# Altium project STM32F446RE_BES.PrjPcb
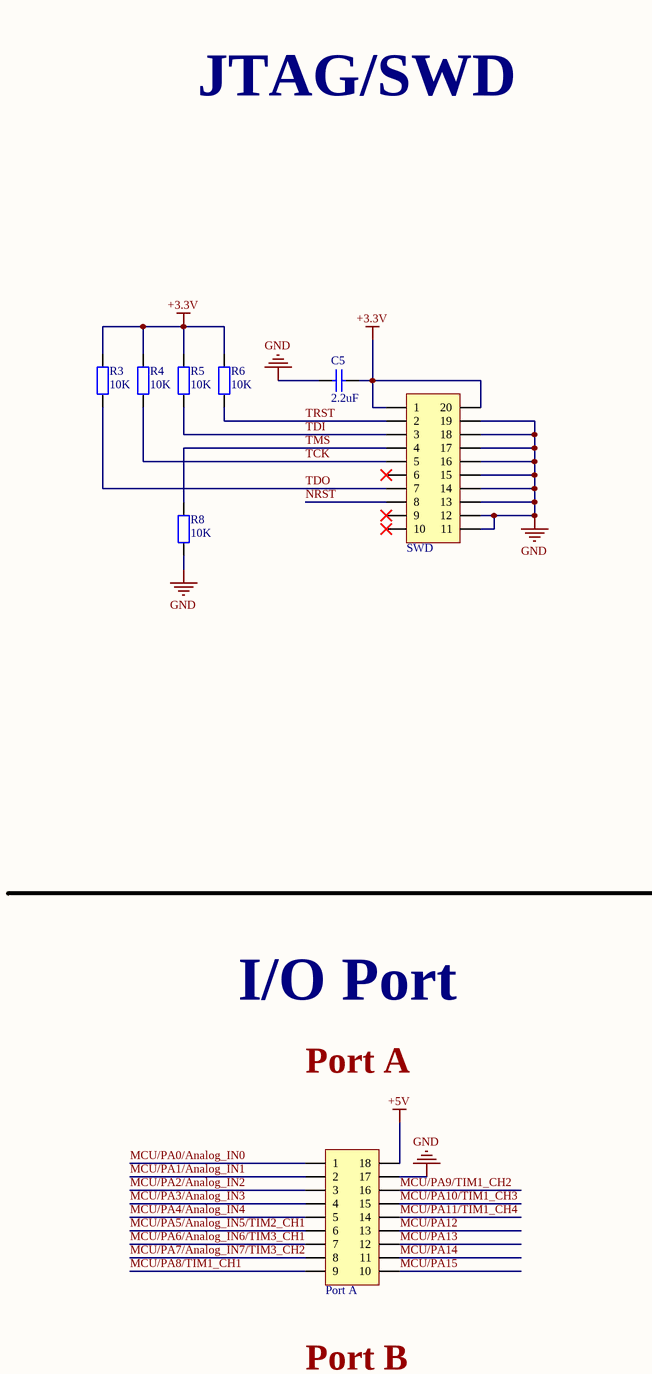
[diagram p0: STM32F446RE_BES.SchDoc, top left]
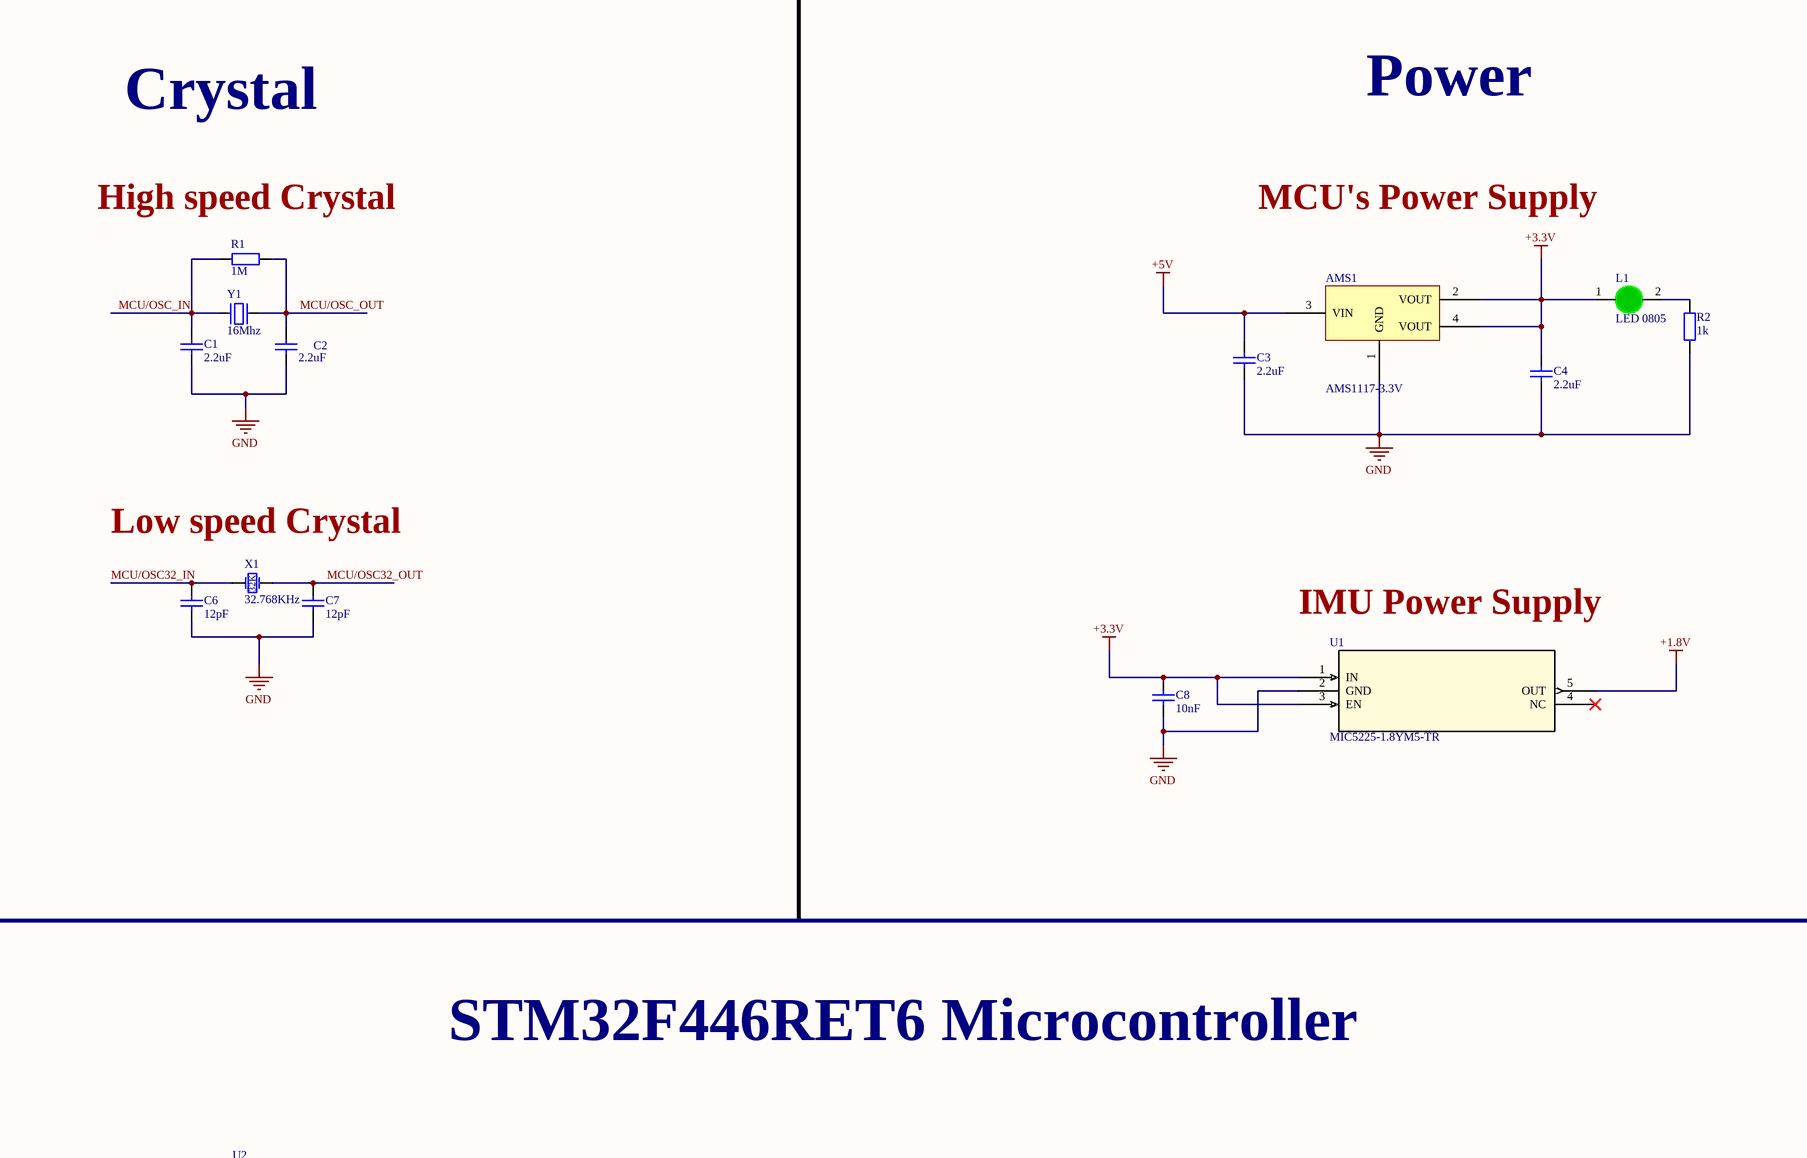
[diagram p1: STM32F446RE_BES.SchDoc, top middle]
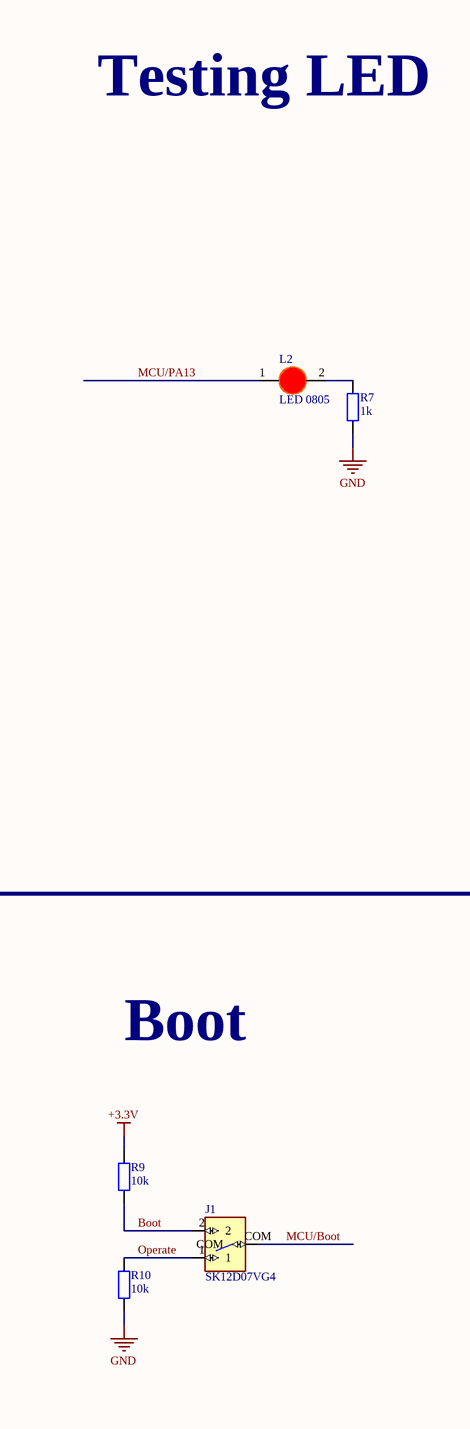
[diagram p2: STM32F446RE_BES.SchDoc, top right]
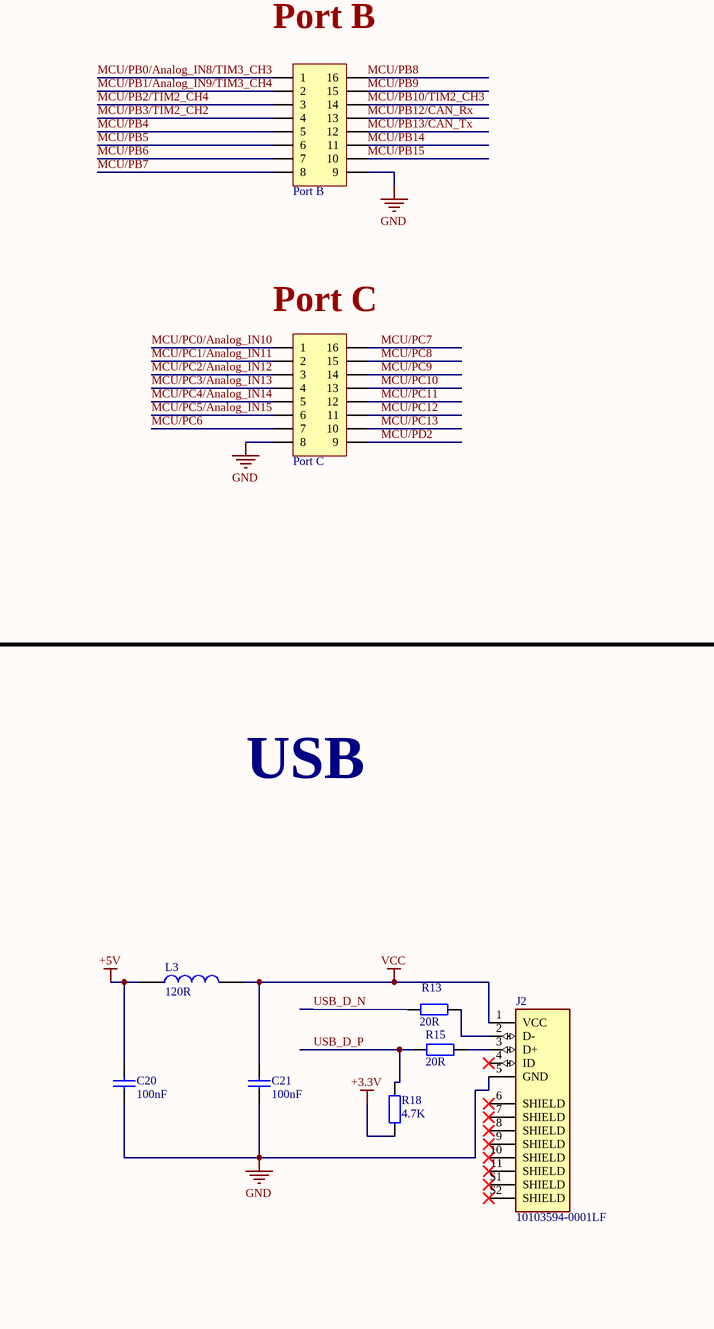
[diagram p3: STM32F446RE_BES.SchDoc, bottom left]
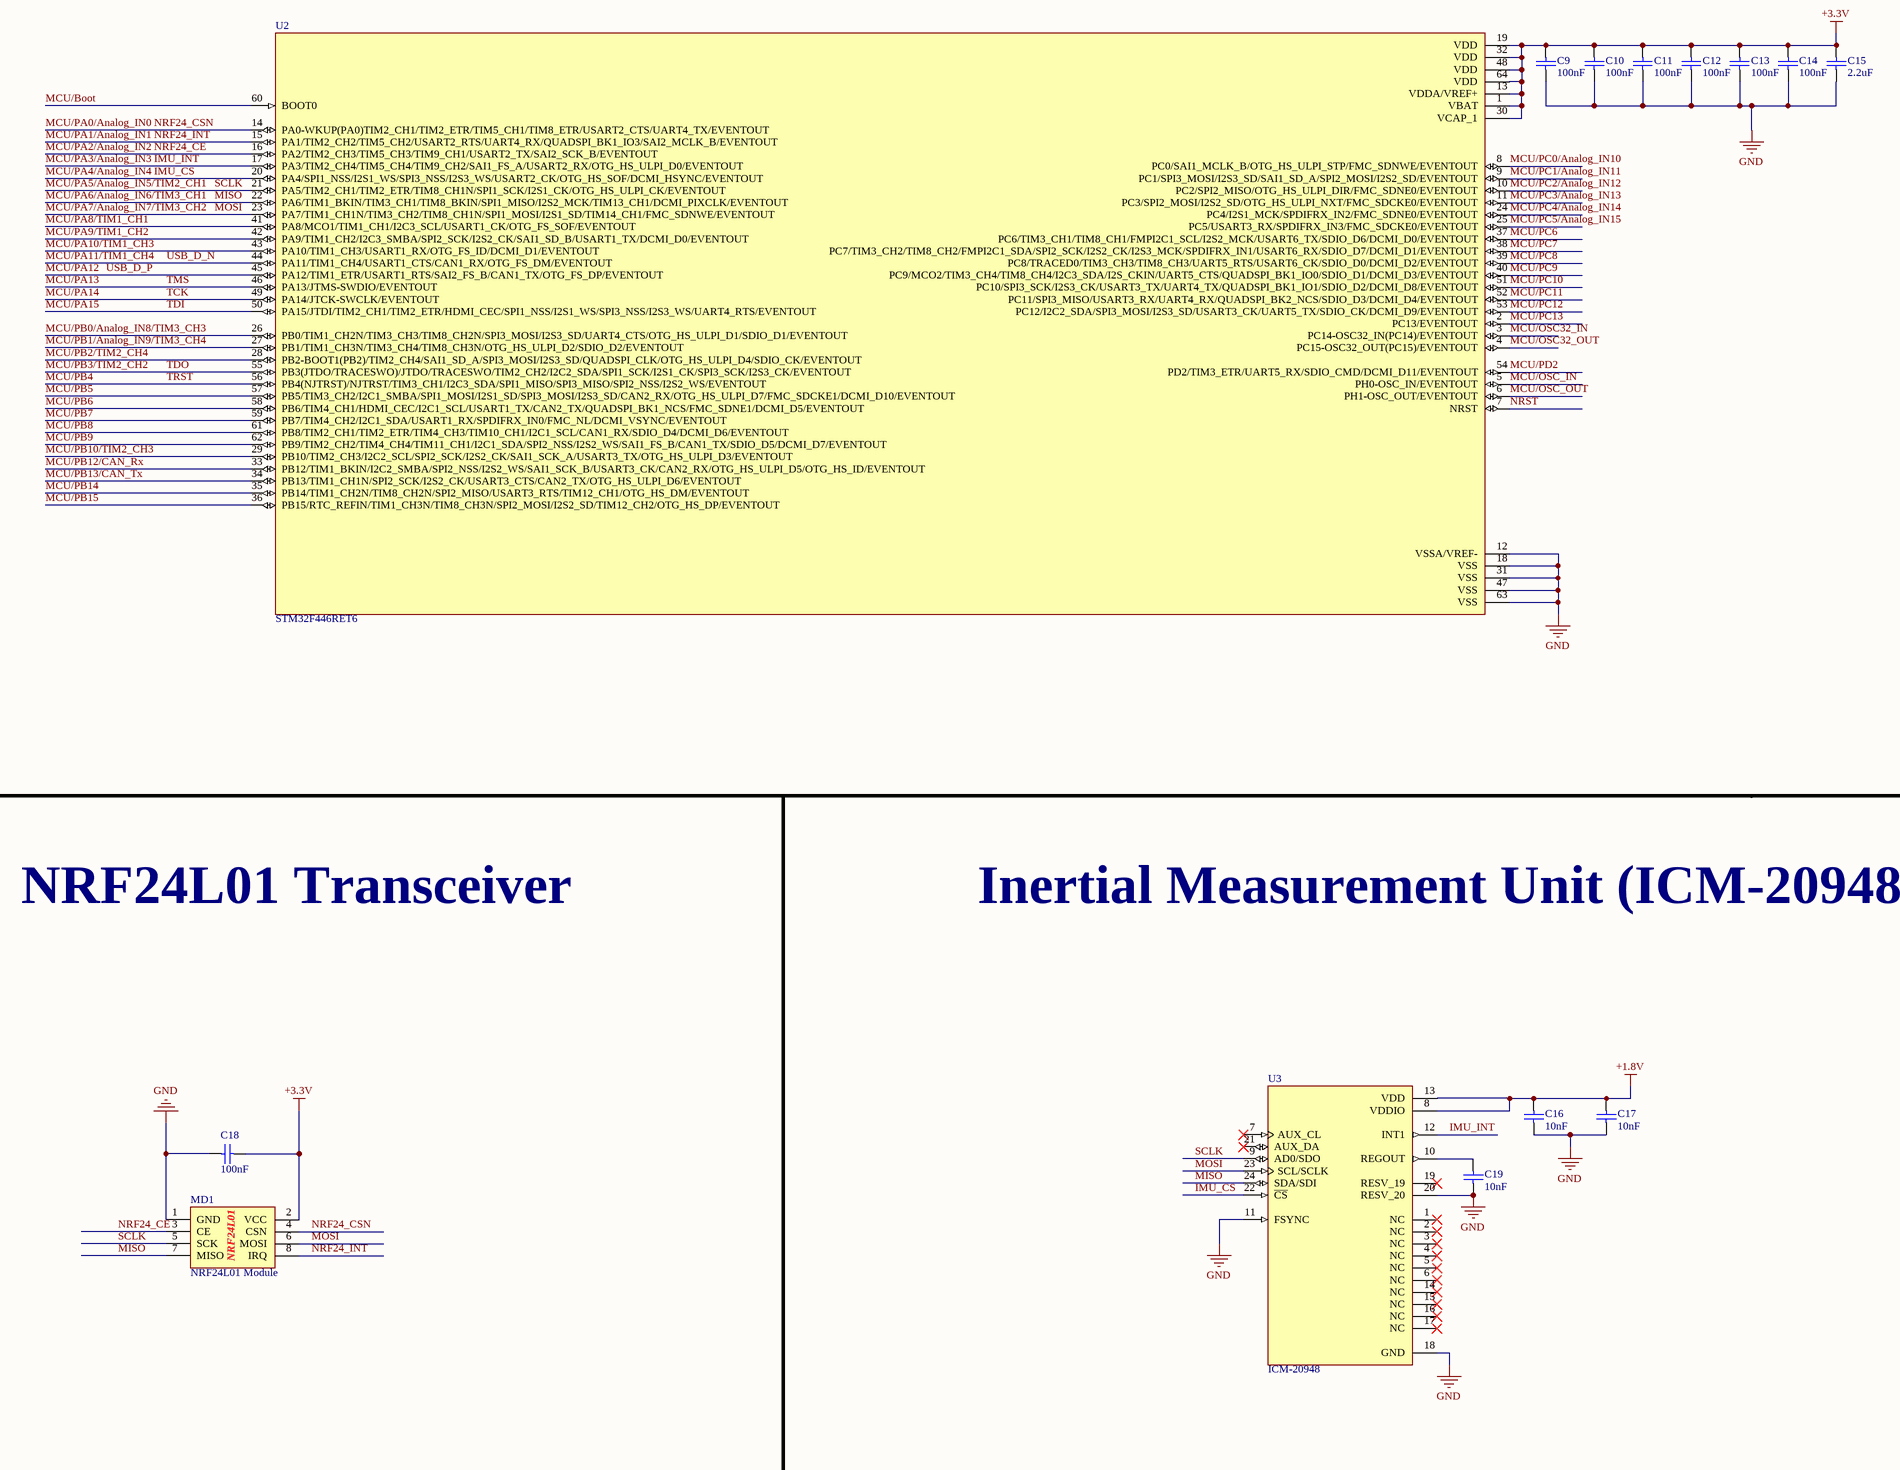
[diagram p4: STM32F446RE_BES.SchDoc, bottom middle]
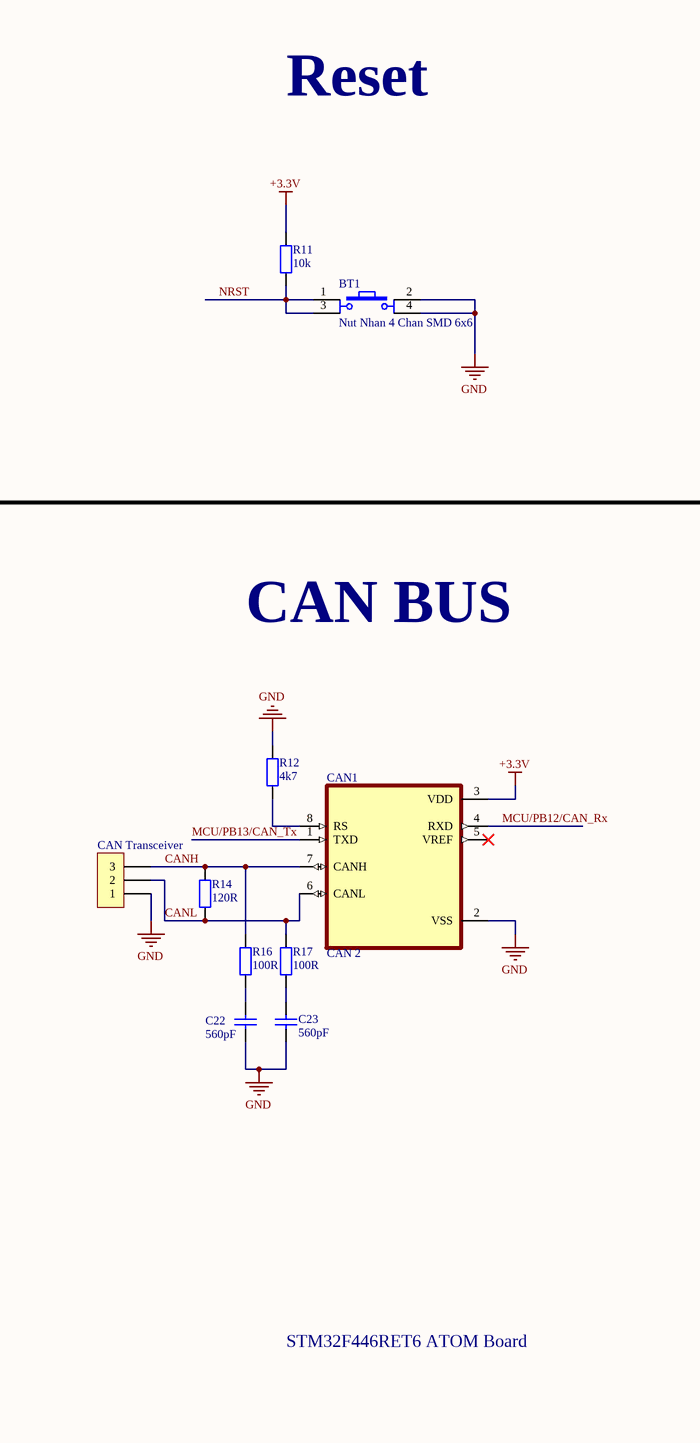
[diagram p5: STM32F446RE_BES.SchDoc, bottom right]
1 sheet, 60 parts. Net scope: global (net labels, ports and power ports of the same name join across sheets).
Board file: STM32F446RE_BES.PcbDoc

## Sheet STM32F446RE_BES.SchDoc
size A1

### Parts
AMS1  AMS1117-3.3V  [SOT223]
BT1  Nut Nhan 4 Chan SMD 6x6  [Nut Nhan 4 Chan SMD 6x6]
C1  2.2uF  [tu 0805]
C2  2.2uF  [tu 0805]
C3  2.2uF  [tu 0805]
C4  2.2uF  [tu 0805]
C5  2.2uF  [tu 0805]
C6  12pF  [tu 0805]
C7  12pF  [tu 0805]
C8  10nF  [tu 0805]
C9  100nF  [tu 0805]
C10  100nF  [tu 0805]
C11  100nF  [tu 0805]
C12  100nF  [tu 0805]
C13  100nF  [tu 0805]
C14  100nF  [tu 0805]
C15  2.2uF  [tu 0805]
C16  10nF  [tu 0805]
C17  10nF  [tu 0805]
C18  100nF  [tu 0805]
C19  10nF  [tu 0805]
C20  100nF  [tu 0805]
C21  100nF  [tu 0805]
C22  560pF  [tu 0805]
C23  560pF  [tu 0805]
CAN1  CAN 2  [SOIC127P599X175-8N]
CAN_1  CAN Transceiver  [XH2.54M-3]
J1  SK12D07VG4  [SK12D07VG4]
J2  10103594-0001LF  [AMPHENOL_10103594-0001LF]
L1  LED 0805  [LED-0805-Green]
L2  LED 0805  [LED-0805-Red]
L3  120R  [IND-0603 (1608)]
MD1  NRF24L01 Module  [NRF24L01]
Port_A  Port A  [JP 2x9 DT]
Port_B  Port B  [JP 2x8 DT]
Port_C  Port C  [JP 2x8 DT]
R1  1M  [tro smd 0805]
R2  1k  [tro smd 0805]
R3  10K  [tro smd 0805]
R4  10K  [tro smd 0805]
R5  10K  [tro smd 0805]
R6  10K  [tro smd 0805]
R7  1k  [tro smd 0805]
R8  10K  [tro smd 0805]
R9  10k  [tro smd 0805]
R10  10k  [tro smd 0805]
R11  10k  [tro smd 0805]
R12  4k7  [tro smd 0805]
R13  20R  [tro smd 0805]
R14  120R  [tro smd 0805]
R15  20R  [tro smd 0805]
R16  100R  [tro smd 0805]
R17  100R  [tro smd 0805]
R18  4.7K  [tro smd 0805]
SWD1  SWD  [JP 2x10 DT]
U1  MIC5225-1.8YM5-TR  [SOT-23-5_M5_MCH]
U2  STM32F446RET6  [QFP50P1200X1200X160-64N]
U3  ICM-20948  [QFN40P300X300X105-24N]
X1  32.768KHz  [Crystal_ABS07_SMD-3.2x1.5MM]
Y1  16Mhz  [Thach Anh 2 chan cam]

### Nets
+1.8V: C16.1 C17.1 U1.5(OUT) U3.8(VDDIO) U3.13(VDD)
+3.3V: AMS1.2(VOUT) AMS1.4(VOUT) C4.1 C5.2 C8.1 C9.1 C10.1 C11.1 C12.1 C13.1 C14.1 C15.1 C18.1 CAN1.3(VDD) L1.1(A) MD1.2(VCC) R3.2 R4.2 R5.2 R6.2 R9.1 R11.1 R18.2 SWD1.1 SWD1.20 U1.1(IN) U1.3(EN) U2.1(VBAT) U2.13(VDDA/VREF+) U2.19(VDD) U2.30(VCAP_1) U2.32(VDD) U2.48(VDD) U2.64(VDD)
+5V: AMS1.3(VIN) C3.1 C20.1 L3.1 Port_A.18
GND: AMS1.1(GND) BT1.2 BT1.4 C1.2 C2.2 C3.2 C4.2 C5.1 C6.2 C7.2 C8.2 C9.2 C10.2 C11.2 C12.2 C13.2 C14.2 C15.2 C16.2 C17.2 C18.2 C19.2 C20.2 C21.2 C22.2 C23.2 CAN1.2(VSS) CAN_1.1 J2.5(GND) MD1.1(GND) Port_A.17 Port_B.9 Port_C.8 R2.2 R7.1 R8.1 R10.2 R12.1 SWD1.11 SWD1.12 SWD1.13 SWD1.14 SWD1.15 SWD1.16 SWD1.17 SWD1.18 SWD1.19 U1.2(GND) U2.12(VSSA/VREF-) U2.18(VSS) U2.31(VSS) U2.47(VSS) U2.63(VSS) U3.11(FSYNC) U3.18(GND) U3.20(RESV_20)
VCC: C21.1 J2.1(VCC) L3.2
Boot: J1.2 R9.2
CANH: CAN1.7(CANH) CAN_1.3 R14.2 R16.2
CANL: CAN1.6(CANL) CAN_1.2 R14.1 R17.2
IMU_CS: Port_A.5 U2.20(PA4/SPI1_NSS/I2S1_WS/SPI3_NSS/I2S3_WS/USART2_CK/OTG_HS_SOF/DCMI_HSYNC/EVENTOUT) U3.22(~{CS})  [also labelled MCU/PA4/Analog_IN4]
IMU_INT: Port_A.4 U2.17(PA3/TIM2_CH4/TIM5_CH4/TIM9_CH2/SAI1_FS_A/USART2_RX/OTG_HS_ULPI_D0/EVENTOUT) U3.12(INT1)  [also labelled MCU/PA3/Analog_IN3]
MCU/Boot: J1.COM U2.60(BOOT0)
MCU/OSC32_IN: C6.1 U2.3(PC14-OSC32_IN(PC14)/EVENTOUT) X1.1(OSC1)
MCU/OSC32_OUT: C7.1 U2.4(PC15-OSC32_OUT(PC15)/EVENTOUT) X1.2(OSC2)
MCU/OSC_IN: C1.1 R1.1 U2.5(PH0-OSC_IN/EVENTOUT) Y1.1
MCU/OSC_OUT: C2.1 R1.2 U2.6(PH1-OSC_OUT/EVENTOUT) Y1.2
MCU/PA0/Analog_IN0: MD1.4(CSN) Port_A.1 U2.14(PA0-WKUP(PA0)TIM2_CH1/TIM2_ETR/TIM5_CH1/TIM8_ETR/USART2_CTS/UART4_TX/EVENTOUT)  [also labelled NRF24_CSN]
MCU/PA1/Analog_IN1: MD1.8(IRQ) Port_A.2 U2.15(PA1/TIM2_CH2/TIM5_CH2/USART2_RTS/UART4_RX/QUADSPI_BK1_IO3/SAI2_MCLK_B/EVENTOUT)  [also labelled NRF24_INT]
MCU/PA2/Analog_IN2: MD1.3(CE) Port_A.3 U2.16(PA2/TIM2_CH3/TIM5_CH3/TIM9_CH1/USART2_TX/SAI2_SCK_B/EVENTOUT)  [also labelled NRF24_CE]
MCU/PA5/Analog_IN5/TIM2_CH1: MD1.5(SCK) Port_A.6 U2.21(PA5/TIM2_CH1/TIM2_ETR/TIM8_CH1N/SPI1_SCK/I2S1_CK/OTG_HS_ULPI_CK/EVENTOUT) U3.9(AD0/SDO)  [also labelled SCLK]
MCU/PA6/Analog_IN6/TIM3_CH1: MD1.7(MISO) Port_A.7 U2.22(PA6/TIM1_BKIN/TIM3_CH1/TIM8_BKIN/SPI1_MISO/I2S2_MCK/TIM13_CH1/DCMI_PIXCLK/EVENTOUT) U3.24(SDA/SDI)  [also labelled MISO]
MCU/PA7/Analog_IN7/TIM3_CH2: MD1.6(MOSI) Port_A.8 U2.23(PA7/TIM1_CH1N/TIM3_CH2/TIM8_CH1N/SPI1_MOSI/I2S1_SD/TIM14_CH1/FMC_SDNWE/EVENTOUT) U3.23(SCL/SCLK)  [also labelled MOSI]
MCU/PA8/TIM1_CH1: Port_A.9 U2.41(PA8/MCO1/TIM1_CH1/I2C3_SCL/USART1_CK/OTG_FS_SOF/EVENTOUT)
MCU/PA9/TIM1_CH2: Port_A.16 U2.42(PA9/TIM1_CH2/I2C3_SMBA/SPI2_SCK/I2S2_CK/SAI1_SD_B/USART1_TX/DCMI_D0/EVENTOUT)
MCU/PA10/TIM1_CH3: Port_A.15 U2.43(PA10/TIM1_CH3/USART1_RX/OTG_FS_ID/DCMI_D1/EVENTOUT)
MCU/PA11/TIM1_CH4: Port_A.14 R13.2 U2.44(PA11/TIM1_CH4/USART1_CTS/CAN1_RX/OTG_FS_DM/EVENTOUT)  [also labelled USB_D_N]
MCU/PA12: Port_A.13 R15.2 R18.1 U2.45(PA12/TIM1_ETR/USART1_RTS/SAI2_FS_B/CAN1_TX/OTG_FS_DP/EVENTOUT)  [also labelled USB_D_P]
MCU/PA13: L2.1(A) Port_A.12 R8.2 SWD1.4 U2.46(PA13/JTMS-SWDIO/EVENTOUT)  [also labelled TMS]
MCU/PA14: Port_A.11 R4.1 SWD1.5 U2.49(PA14/JTCK-SWCLK/EVENTOUT)  [also labelled TCK]
MCU/PA15: Port_A.10 R5.1 SWD1.3 U2.50(PA15/JTDI/TIM2_CH1/TIM2_ETR/HDMI_CEC/SPI1_NSS/I2S1_WS/SPI3_NSS/I2S3_WS/UART4_RTS/EVENTOUT)  [also labelled TDI]
MCU/PB0/Analog_IN8/TIM3_CH3: Port_B.1 U2.26(PB0/TIM1_CH2N/TIM3_CH3/TIM8_CH2N/SPI3_MOSI/I2S3_SD/UART4_CTS/OTG_HS_ULPI_D1/SDIO_D1/EVENTOUT)
MCU/PB1/Analog_IN9/TIM3_CH4: Port_B.2 U2.27(PB1/TIM1_CH3N/TIM3_CH4/TIM8_CH3N/OTG_HS_ULPI_D2/SDIO_D2/EVENTOUT)
MCU/PB2/TIM2_CH4: Port_B.3 U2.28(PB2-BOOT1(PB2)/TIM2_CH4/SAI1_SD_A/SPI3_MOSI/I2S3_SD/QUADSPI_CLK/OTG_HS_ULPI_D4/SDIO_CK/EVENTOUT)
MCU/PB3/TIM2_CH2: Port_B.4 R3.1 SWD1.7 U2.55(PB3(JTDO/TRACESWO)/JTDO/TRACESWO/TIM2_CH2/I2C2_SDA/SPI1_SCK/I2S1_CK/SPI3_SCK/I2S3_CK/EVENTOUT)  [also labelled TDO]
MCU/PB4: Port_B.5 R6.1 SWD1.2 U2.56(PB4(NJTRST)/NJTRST/TIM3_CH1/I2C3_SDA/SPI1_MISO/SPI3_MISO/SPI2_NSS/I2S2_WS/EVENTOUT)  [also labelled TRST]
MCU/PB5: Port_B.6 U2.57(PB5/TIM3_CH2/I2C1_SMBA/SPI1_MOSI/I2S1_SD/SPI3_MOSI/I2S3_SD/CAN2_RX/OTG_HS_ULPI_D7/FMC_SDCKE1/DCMI_D10/EVENTOUT)
MCU/PB6: Port_B.7 U2.58(PB6/TIM4_CH1/HDMI_CEC/I2C1_SCL/USART1_TX/CAN2_TX/QUADSPI_BK1_NCS/FMC_SDNE1/DCMI_D5/EVENTOUT)
MCU/PB7: Port_B.8 U2.59(PB7/TIM4_CH2/I2C1_SDA/USART1_RX/SPDIFRX_IN0/FMC_NL/DCMI_VSYNC/EVENTOUT)
MCU/PB8: Port_B.16 U2.61(PB8/TIM2_CH1/TIM2_ETR/TIM4_CH3/TIM10_CH1/I2C1_SCL/CAN1_RX/SDIO_D4/DCMI_D6/EVENTOUT)
MCU/PB9: Port_B.15 U2.62(PB9/TIM2_CH2/TIM4_CH4/TIM11_CH1/I2C1_SDA/SPI2_NSS/I2S2_WS/SAI1_FS_B/CAN1_TX/SDIO_D5/DCMI_D7/EVENTOUT)
MCU/PB10/TIM2_CH3: Port_B.14 U2.29(PB10/TIM2_CH3/I2C2_SCL/SPI2_SCK/I2S2_CK/SAI1_SCK_A/USART3_TX/OTG_HS_ULPI_D3/EVENTOUT)
MCU/PB12/CAN_Rx: CAN1.4(RXD) Port_B.13 U2.33(PB12/TIM1_BKIN/I2C2_SMBA/SPI2_NSS/I2S2_WS/SAI1_SCK_B/USART3_CK/CAN2_RX/OTG_HS_ULPI_D5/OTG_HS_ID/EVENTOUT)
MCU/PB13/CAN_Tx: CAN1.1(TXD) Port_B.12 U2.34(PB13/TIM1_CH1N/SPI2_SCK/I2S2_CK/USART3_CTS/CAN2_TX/OTG_HS_ULPI_D6/EVENTOUT)
MCU/PB14: Port_B.11 U2.35(PB14/TIM1_CH2N/TIM8_CH2N/SPI2_MISO/USART3_RTS/TIM12_CH1/OTG_HS_DM/EVENTOUT)
MCU/PB15: Port_B.10 U2.36(PB15/RTC_REFIN/TIM1_CH3N/TIM8_CH3N/SPI2_MOSI/I2S2_SD/TIM12_CH2/OTG_HS_DP/EVENTOUT)
MCU/PC0/Analog_IN10: Port_C.1 U2.8(PC0/SAI1_MCLK_B/OTG_HS_ULPI_STP/FMC_SDNWE/EVENTOUT)
MCU/PC1/Analog_IN11: Port_C.2 U2.9(PC1/SPI3_MOSI/I2S3_SD/SAI1_SD_A/SPI2_MOSI/I2S2_SD/EVENTOUT)
MCU/PC2/Analog_IN12: Port_C.3 U2.10(PC2/SPI2_MISO/OTG_HS_ULPI_DIR/FMC_SDNE0/EVENTOUT)
MCU/PC3/Analog_IN13: Port_C.4 U2.11(PC3/SPI2_MOSI/I2S2_SD/OTG_HS_ULPI_NXT/FMC_SDCKE0/EVENTOUT)
MCU/PC4/Analog_IN14: Port_C.5 U2.24(PC4/I2S1_MCK/SPDIFRX_IN2/FMC_SDNE0/EVENTOUT)
MCU/PC5/Analog_IN15: Port_C.6 U2.25(PC5/USART3_RX/SPDIFRX_IN3/FMC_SDCKE0/EVENTOUT)
MCU/PC6: Port_C.7 U2.37(PC6/TIM3_CH1/TIM8_CH1/FMPI2C1_SCL/I2S2_MCK/USART6_TX/SDIO_D6/DCMI_D0/EVENTOUT)
MCU/PC7: Port_C.16 U2.38(PC7/TIM3_CH2/TIM8_CH2/FMPI2C1_SDA/SPI2_SCK/I2S2_CK/I2S3_MCK/SPDIFRX_IN1/USART6_RX/SDIO_D7/DCMI_D1/EVENTOUT)
MCU/PC8: Port_C.15 U2.39(PC8/TRACED0/TIM3_CH3/TIM8_CH3/UART5_RTS/USART6_CK/SDIO_D0/DCMI_D2/EVENTOUT)
MCU/PC9: Port_C.14 U2.40(PC9/MCO2/TIM3_CH4/TIM8_CH4/I2C3_SDA/I2S_CKIN/UART5_CTS/QUADSPI_BK1_IO0/SDIO_D1/DCMI_D3/EVENTOUT)
MCU/PC10: Port_C.13 U2.51(PC10/SPI3_SCK/I2S3_CK/USART3_TX/UART4_TX/QUADSPI_BK1_IO1/SDIO_D2/DCMI_D8/EVENTOUT)
MCU/PC11: Port_C.12 U2.52(PC11/SPI3_MISO/USART3_RX/UART4_RX/QUADSPI_BK2_NCS/SDIO_D3/DCMI_D4/EVENTOUT)
MCU/PC12: Port_C.11 U2.53(PC12/I2C2_SDA/SPI3_MOSI/I2S3_SD/USART3_CK/UART5_TX/SDIO_CK/DCMI_D9/EVENTOUT)
MCU/PC13: Port_C.10 U2.2(PC13/EVENTOUT)
MCU/PD2: Port_C.9 U2.54(PD2/TIM3_ETR/UART5_RX/SDIO_CMD/DCMI_D11/EVENTOUT)
NRST: BT1.1 BT1.3 R11.2 SWD1.8 U2.7(NRST)
Operate: J1.1 R10.1
NetC19_1: C19.1 U3.10(REGOUT)
NetC22_1: C22.1 R16.1
NetC23_1: C23.1 R17.1
NetCAN1_8: CAN1.8(RS) R12.2
NetJ2_2: J2.2(D-) R13.1
NetJ2_3: J2.3(D+) R15.1
NetL1_2: L1.2(K) R2.1
NetL2_2: L2.2(K) R7.2

Not connected (* = marked no-connect by the designer): CAN1 5(VREF)*; J2 4(ID)* 6(SHIELD)* 7(SHIELD)* 8(SHIELD)* 9(SHIELD)* 10(SHIELD)* 11(SHIELD)* S1(SHIELD)* S2(SHIELD)*; SWD1 6* 9* 10*; U1 4(NC)*; U3 1(NC)* 2(NC)* 3(NC)* 4(NC)* 5(NC)* 6(NC)* 7(AUX_CL)* 14(NC)* 15(NC)* 16(NC)* 17(NC)* 19(RESV_19)* 21(AUX_DA)*

### Notes on the sheet
- JTAG/SWD
- Crystal
- Power
- Testing LED
- (near R1) High speed Crystal
- MCU's Power Supply
- Low speed Crystal
- IMU Power Supply
- I/O Port
- STM32F446RET6 Microcontroller
- Boot
- Port A
- (near Port_B) Port B
- Reset
- (near Port_C) Port C
- USB
- NRF24L01 Transceiver
- Inertial Measurement Unit (ICM-20948)
- CAN BUS
- STM32F446RET6 ATOM Board
- Title
- Size:
- Date:
- File:
- A1
- Number:
- Time:
- Revision:
- Sheet
- of
- (in symbol ABS07-32.768KHZ-T) 32K
- (in symbol NRF24L01 Module) NRF24L01

### Library data of the parts
AMS1 = AMS1117 SMD: Dán; Value: AMS1117-3.3V SOT223; Don_Vi: Con; Ma_Hang: MH000596; Ghi_Chu: *; Kieu_Chan: *; Chung_Loai: Dán
BT1 = Nut Nhan 4 Chan SMD 6x6: Nut Nhan 4 Chan 6.2x6.2x3.5; Ten: Nút Nhấn 4 Chân 6.2x6.2x3.1MM SMD; Ma_Hang: MH002424
C1-C7 C9-C15 = Tu 0805 10pF 50V 10%: Dán; Don_Vi: Con; So_Chan: 2; Ten_Linh_Kien: Tụ 0805 10P 10% 50V; Ma_Hang: MH004554; Chung_Loai: Dán; Kieu_Chan: *
C8 C16-C23 = Tu 0805 106 16V 10%: Dán; Ten_Linh_Kien: Tụ 0805 106-10uF 10% 16V; So_Chan: 2; Don_Vi: Con; Ma_Hang: MH004553; Chung_Loai: Dán; Kieu_Chan: *
CAN1 = MCP2551-I/SN: MF: {'manufacturer': u'Microchip Technology'}; Package: None; Price: None; Value: *; MP: MCP2551-I/SN; Availability: Unavailable
CAN_1 = Header 3P 2.54 Duc Thang: Cắm; Ten_Linh_Kien: Header 3P XH2.54-3P Đực Thẳng; Don_Vi: Con; Ma_Hang: MH001292; Chung_Loai: Cắm
J1 = SK12D07VG4: Switch Slide ON ON SPDT Side Slide 0.3A 30VDC PC Pins Bracket Mount/Through Hole Bulk; MF: C&K; Price: None; Check_prices: https://www.snapeda.com/parts/SK12D07VG4/C&K/view-part/6618061/?ref=eda; SnapEDA_Link: https://www.snapeda.com/parts/SK12D07VG4/C&K/view-part/6618061/?ref=snap; Package: None; Availability: Not in stock; MP: SK12D07VG4; Value: *
J2 = 10103594-0001LF: USB - micro B USB 2.0 Receptacle Connector 5 Position Surface Mount, Right Angle; Through Hole; MF: {'manufacturer': u'FCI Connectors'}; Package: None; Price: None; Value: *; MP: 10103594-0001LF; Availability: Unavailable
L1 = LED 0805 Xanh La: Dán; Don_Vi: Con; Ma_Hang: MH002326; Ten_Linh_Kien: LED 0805 Màu Xanh Lá (Green); Ghi_Chu: *; Kieu_Chan: *; Chung_Loai: Dán
L2 = LED 0805 Do: Dán; Don_Vi: Con; Ma_Hang: MH000897; Ten_Linh_Kien: LED 0805 Màu Đỏ (Red); Ghi_Chu: *; Kieu_Chan: *; Chung_Loai: Dán
L3 = FBMJ1608HM230NT: IND-FERRITE BEAD 23 OHM  4A 0603 1LN; CompanyID: VT-01060; Solder: SMT; Value: 23R/4A; MPN: FBMJ1608HM230NT; Category: FERRITE BEAD; PinCount: 2
Port_A = JP 2x9 2.54 Duc Thang: Cắm; Ten_Linh_Kien: Jump Đôi Đực 2.54MM 2x40P Thẳng 11MM; Don_Vi: Con; Ma_Hang: MH002686; Ghi_Chu: *; Kieu_Chan: *; Chung_Loai: Cắm
Port_B Port_C = JP 2x8 2.54 Duc Thang: Cắm; Ten_Linh_Kien: Jump Đôi Đực 2.54MM 2x40P Thẳng 11MM; Don_Vi: Con; Ma_Hang: MH002686; Ghi_Chu: *; Kieu_Chan: *; Chung_Loai: Cắm
R1 R2 R7 R9-R11 = Tro 0805 1% 1k: Dán; Don_Vi: Con; So_Chan: 2; Ten_Linh_Kien: Trở 0805 1% 1k; Ma_Hang: MH005468; Chung_Loai: Dán; Kieu_Chan: *
R3-R6 R8 R12-R18 = Tro 0805 1% 10k: Dán; Don_Vi: Con; So_Chan: 2; Ten_Linh_Kien: Trở 0805 1% 10k; Ma_Hang: MH005473; Chung_Loai: Dán; Kieu_Chan: *
SWD1 = JP 2x10 2.54 Duc Thang: Cắm; Ten_Linh_Kien: Jump Đôi Đực 2.54MM 2x40P Thẳng 11MM; Don_Vi: Con; Ma_Hang: MH002686; Ghi_Chu: *; Kieu_Chan: *; Chung_Loai: Cắm
U1 = MIC5225-1.8YM5-TR: No Description Available; Mfr_Name: Microchip; RefDes: RefDes; Type: Type
U2 = STM32F446RET6: MCU 32-Bit STM32 ARM Cortex M4 RISC 512KB Flash 2.5V/3.3V 64-Pin LQFP Tray; MF: {'manufacturer': u'STMicroelectronics'}; Package: None; Price: None; Value: *; MP: STM32F446RET6; Availability: Unavailable
U3 = ICM-20948: Accelerometer, Gyroscope, Magnetometer, 9 Axis Sensor IÂ²C, SPI Output; Package: None; Value: *; Price: None; MP: ICM-20948; Availability: Unavailable
X1 = ABS07-32.768KHZ-T: CRYSTAL 32.7680KHZ 12.5pF SMD; Solder: SMT; CompanyID: VT-01153; MPN: ABS07-32.768KHZ-T; Value: 32.768KHz; Category: CRYSTAL
Y1 = Thach Anh 2 chan Cam: Crystal For all Crystal 2pin.; Value: 4Mhz